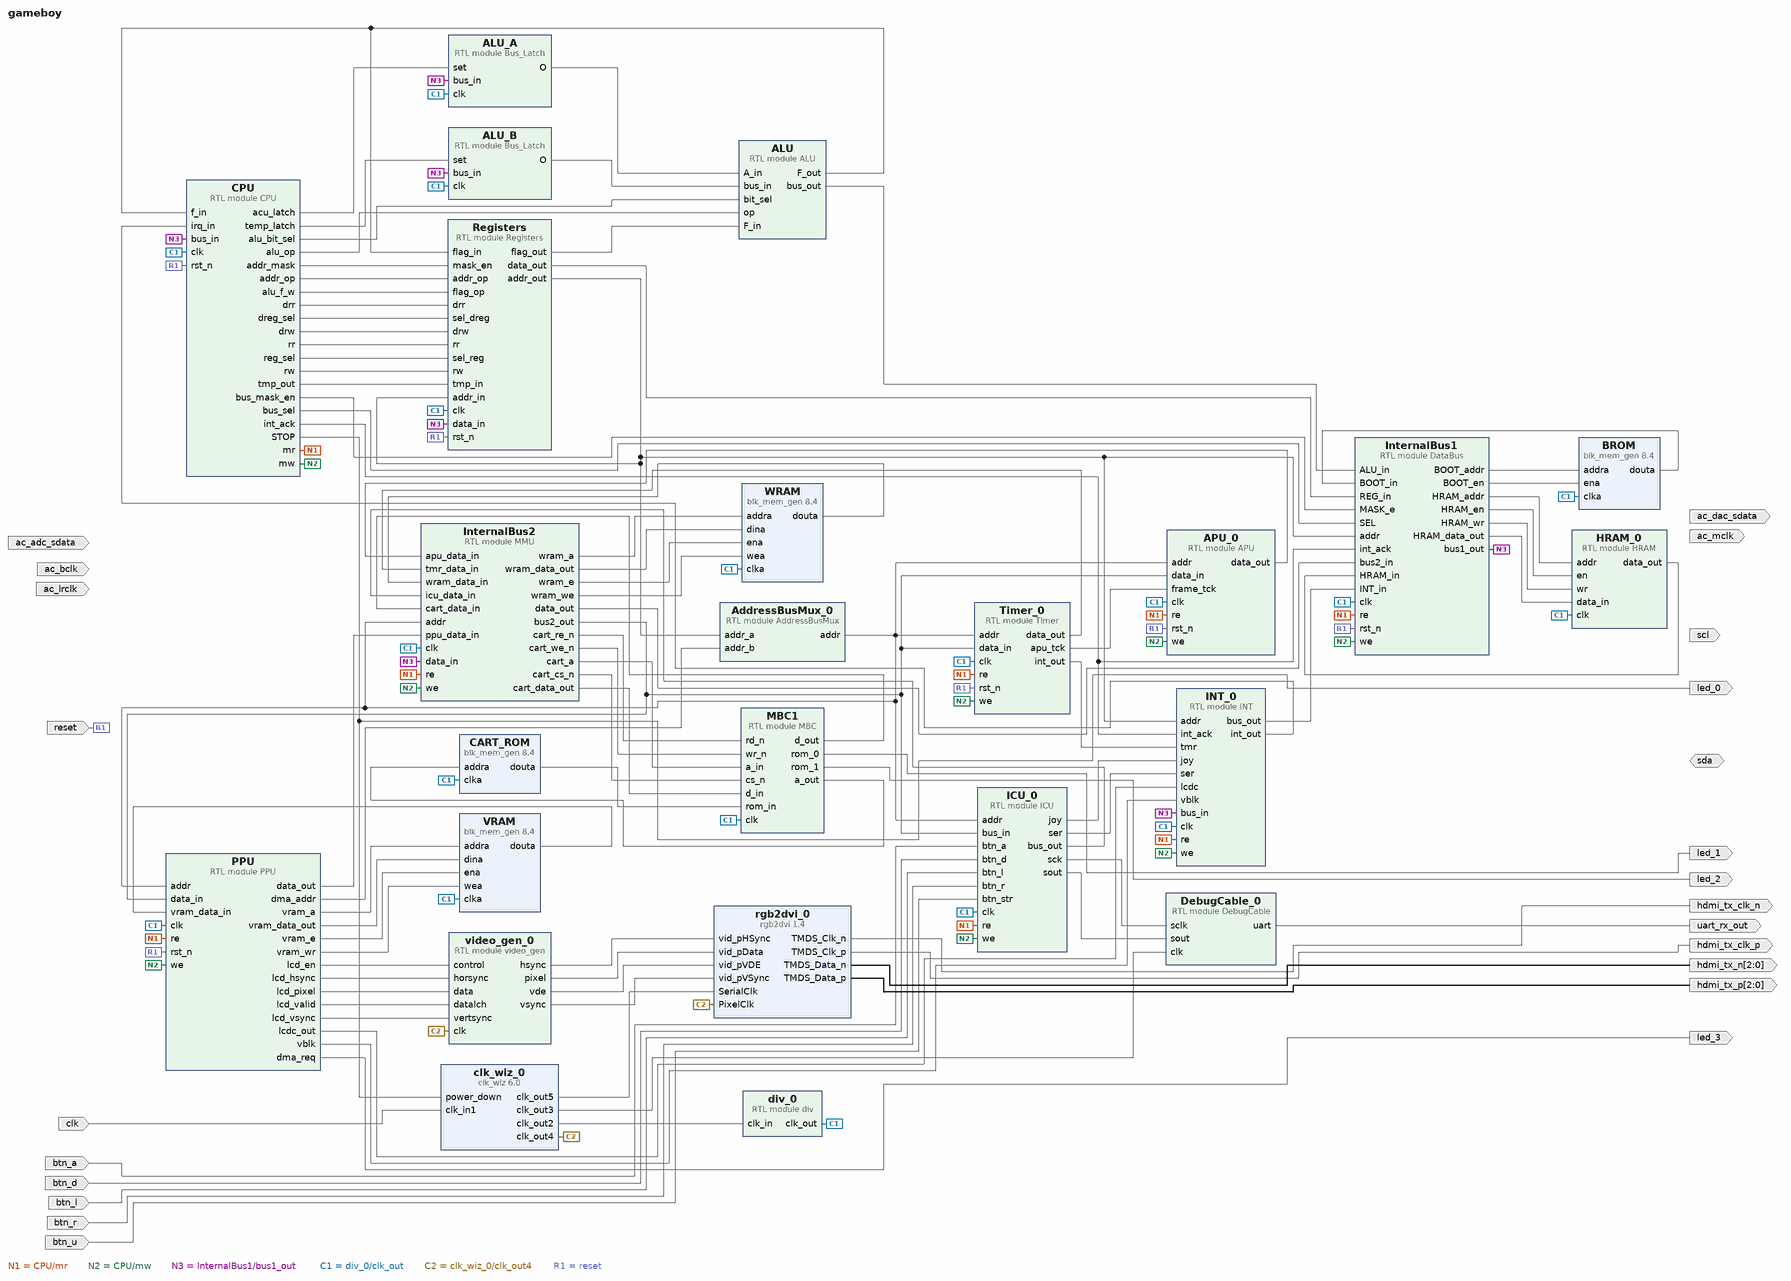
[diagram p0: block diagram of the top level]
# Vivado block design gameboy, xc7a200tsbg484-1, Vivado 2021.2
create_bd_design gameboy

create_bd_port -dir I -type data btn_a
create_bd_port -dir I -type clk clk
set_property -dict {CONFIG.FREQ_HZ 100000000} [get_bd_ports clk]
create_bd_port -dir O -type data led_0
create_bd_port -dir O -type data led_1
create_bd_port -dir O -type data led_2
create_bd_port -dir I -type rst reset
create_bd_port -dir O -type data led_3
create_bd_port -dir IO -type data sda
create_bd_port -dir O -type data scl
create_bd_port -dir I -type data ac_bclk
create_bd_port -dir I -type data ac_lrclk
create_bd_port -dir O -type data ac_dac_sdata
create_bd_port -dir O -type data ac_mclk
create_bd_port -dir I -type data ac_adc_sdata
create_bd_port -dir O -type data uart_rx_out
create_bd_port -dir I -type data btn_l
create_bd_port -dir I -type data btn_r
create_bd_port -dir O -type data hdmi_tx_clk_n
create_bd_port -dir O -type data hdmi_tx_clk_p
create_bd_port -dir O -from 2 -to 0 -type data hdmi_tx_n
create_bd_port -dir O -from 2 -to 0 -type data hdmi_tx_p
create_bd_port -dir I -type data btn_u
create_bd_port -dir I -type data btn_d

create_bd_cell -type ip -vlnv xilinx.com:ip:blk_mem_gen:8.4 WRAM
set_property -dict [list \
  CONFIG.Enable_32bit_Address false \
  CONFIG.Enable_A Use_ENA_Pin \
  CONFIG.Operating_Mode_A READ_FIRST \
  CONFIG.Read_Width_A 8 \
  CONFIG.Register_PortA_Output_of_Memory_Core false \
  CONFIG.Register_PortA_Output_of_Memory_Primitives false \
  CONFIG.Use_Byte_Write_Enable false \
  CONFIG.Use_RSTA_Pin false \
  CONFIG.Write_Depth_A 8192 \
  CONFIG.Write_Width_A 8 \
  CONFIG.use_bram_block Stand_Alone \
] [get_bd_cells WRAM]
create_bd_cell -type ip -vlnv xilinx.com:ip:blk_mem_gen:8.4 BROM
set_property -dict [list \
  CONFIG.Coe_File ../../../../../../../Downloads/COEGen-0.01/dmg_boot.bin.coe \
  CONFIG.Enable_32bit_Address false \
  CONFIG.Load_Init_File true \
  CONFIG.Memory_Type Single_Port_ROM \
  CONFIG.Port_A_Write_Rate 0 \
  CONFIG.Register_PortA_Output_of_Memory_Primitives false \
  CONFIG.Use_RSTA_Pin false \
  CONFIG.Write_Depth_A 256 \
  CONFIG.Write_Width_A 8 \
  CONFIG.use_bram_block Stand_Alone \
] [get_bd_cells BROM]
create_bd_cell -type ip -vlnv xilinx.com:ip:blk_mem_gen:8.4 CART_ROM
set_property -dict [list \
  CONFIG.Coe_File ../../../../../../../Downloads/COEGen-0.01/01-special.gb.coe \
  CONFIG.Enable_32bit_Address false \
  CONFIG.Enable_A Always_Enabled \
  CONFIG.Fill_Remaining_Memory_Locations false \
  CONFIG.Load_Init_File true \
  CONFIG.Memory_Type Single_Port_ROM \
  CONFIG.Port_A_Write_Rate 0 \
  CONFIG.Register_PortA_Output_of_Memory_Core false \
  CONFIG.Register_PortA_Output_of_Memory_Primitives false \
  CONFIG.Use_RSTA_Pin false \
  CONFIG.Write_Depth_A 65536 \
  CONFIG.Write_Width_A 8 \
  CONFIG.use_bram_block Stand_Alone \
] [get_bd_cells CART_ROM]
create_bd_cell -type ip -vlnv xilinx.com:ip:blk_mem_gen:8.4 VRAM
set_property -dict [list \
  CONFIG.Enable_32bit_Address false \
  CONFIG.Operating_Mode_A WRITE_FIRST \
  CONFIG.Read_Width_A 8 \
  CONFIG.Register_PortA_Output_of_Memory_Core false \
  CONFIG.Register_PortA_Output_of_Memory_Primitives false \
  CONFIG.Use_Byte_Write_Enable false \
  CONFIG.Use_RSTA_Pin false \
  CONFIG.Write_Depth_A 8192 \
  CONFIG.Write_Width_A 8 \
  CONFIG.use_bram_block Stand_Alone \
] [get_bd_cells VRAM]
create_bd_cell -type ip -vlnv xilinx.com:ip:clk_wiz:6.0 clk_wiz_0
set_property -dict [list \
  CONFIG.CLKOUT1_DRIVES BUFGCE \
  CONFIG.CLKOUT1_JITTER 147.252 \
  CONFIG.CLKOUT1_PHASE_ERROR 94.994 \
  CONFIG.CLKOUT1_REQUESTED_OUT_FREQ 48 \
  CONFIG.CLKOUT2_DRIVES BUFGCE \
  CONFIG.CLKOUT2_JITTER 209.561 \
  CONFIG.CLKOUT2_PHASE_ERROR 94.994 \
  CONFIG.CLKOUT2_REQUESTED_OUT_FREQ 8.4 \
  CONFIG.CLKOUT2_USED true \
  CONFIG.CLKOUT3_DRIVES BUFGCE \
  CONFIG.CLKOUT3_JITTER 198.395 \
  CONFIG.CLKOUT3_PHASE_ERROR 94.994 \
  CONFIG.CLKOUT3_REQUESTED_OUT_FREQ 11.17021 \
  CONFIG.CLKOUT3_USED true \
  CONFIG.CLKOUT4_DRIVES BUFGCE \
  CONFIG.CLKOUT4_JITTER 158.056 \
  CONFIG.CLKOUT4_PHASE_ERROR 94.994 \
  CONFIG.CLKOUT4_REQUESTED_OUT_FREQ 35 \
  CONFIG.CLKOUT4_USED true \
  CONFIG.CLKOUT5_DRIVES BUFGCE \
  CONFIG.CLKOUT5_JITTER 113.523 \
  CONFIG.CLKOUT5_PHASE_ERROR 94.994 \
  CONFIG.CLKOUT5_REQUESTED_OUT_FREQ 175 \
  CONFIG.CLKOUT5_SEQUENCE_NUMBER 1 \
  CONFIG.CLKOUT5_USED true \
  CONFIG.CLKOUT6_DRIVES BUFGCE \
  CONFIG.CLKOUT7_DRIVES BUFGCE \
  CONFIG.FEEDBACK_SOURCE FDBK_AUTO \
  CONFIG.MMCM_CLKFBOUT_MULT_F 10.500 \
  CONFIG.MMCM_CLKIN1_PERIOD 10.000 \
  CONFIG.MMCM_CLKIN2_PERIOD 10.000 \
  CONFIG.MMCM_CLKOUT0_DIVIDE_F 21.875 \
  CONFIG.MMCM_CLKOUT1_DIVIDE 125 \
  CONFIG.MMCM_CLKOUT2_DIVIDE 94 \
  CONFIG.MMCM_CLKOUT3_DIVIDE 30 \
  CONFIG.MMCM_CLKOUT4_DIVIDE 6 \
  CONFIG.MMCM_DIVCLK_DIVIDE 1 \
  CONFIG.NUM_OUT_CLKS 5 \
  CONFIG.USE_CLOCK_SEQUENCING false \
  CONFIG.USE_LOCKED false \
  CONFIG.USE_POWER_DOWN true \
  CONFIG.USE_RESET false \
  CONFIG.USE_SAFE_CLOCK_STARTUP true \
] [get_bd_cells clk_wiz_0]
create_bd_cell -type ip -vlnv digilentinc.com:ip:rgb2dvi:1.4 rgb2dvi_0
set_property -dict {CONFIG.kGenerateSerialClk false} [get_bd_cells rgb2dvi_0]
create_bd_cell -type module -reference ALU ALU
create_bd_cell -type module -reference DataBus InternalBus1
create_bd_cell -type module -reference CPU CPU
create_bd_cell -type module -reference ICU ICU_0
create_bd_cell -type module -reference INT INT_0
create_bd_cell -type module -reference MBC MBC1
create_bd_cell -type module -reference MMU InternalBus2
create_bd_cell -type module -reference PPU PPU
create_bd_cell -type module -reference Registers Registers
create_bd_cell -type module -reference AddressBusMux AddressBusMux_0
create_bd_cell -type module -reference APU APU_0
create_bd_cell -type module -reference Bus_Latch ALU_B
create_bd_cell -type module -reference Bus_Latch ALU_A
create_bd_cell -type module -reference DebugCable DebugCable_0
create_bd_cell -type module -reference div div_0
create_bd_cell -type module -reference HRAM HRAM_0
create_bd_cell -type module -reference Timer Timer_0
create_bd_cell -type module -reference video_gen video_gen_0

# ---- connections ----

connect_bd_net [get_bd_pins ALU/F_out] [get_bd_pins CPU/f_in] [get_bd_pins Registers/flag_in]
connect_bd_net [get_bd_pins ALU/bus_out] [get_bd_pins InternalBus1/ALU_in]
connect_bd_net [get_bd_pins APU_0/data_out] [get_bd_pins InternalBus2/apu_data_in]
connect_bd_net [get_bd_pins AddressBusMux_0/addr] \
  [get_bd_pins ICU_0/addr] [get_bd_pins InternalBus2/addr] [get_bd_pins PPU/addr] [get_bd_pins APU_0/addr] \
  [get_bd_pins Timer_0/addr]
connect_bd_net [get_bd_pins BROM/douta] [get_bd_pins InternalBus1/BOOT_in]
connect_bd_net -net Bus_Latch_0_O [get_bd_pins ALU_B/O] [get_bd_pins ALU/bus_in]
connect_bd_net -net Bus_Latch_0_O1 [get_bd_pins ALU_A/O] [get_bd_pins ALU/A_in]
connect_bd_net [get_bd_pins CART_ROM/douta] [get_bd_pins MBC1/rom_in]
connect_bd_net [get_bd_pins CPU/STOP] [get_bd_ports led_0] [get_bd_pins clk_wiz_0/power_down]
connect_bd_net [get_bd_pins CPU/acu_latch] [get_bd_pins ALU_A/set]
connect_bd_net -net CPU_addr [get_bd_pins Registers/addr_out] \
  [get_bd_pins InternalBus1/addr] [get_bd_pins INT_0/addr] [get_bd_pins Registers/addr_in] \
  [get_bd_pins AddressBusMux_0/addr_a]
connect_bd_net [get_bd_pins CPU/addr_mask] [get_bd_pins Registers/mask_en]
connect_bd_net [get_bd_pins CPU/addr_op] [get_bd_pins Registers/addr_op]
connect_bd_net [get_bd_pins CPU/alu_bit_sel] [get_bd_pins ALU/bit_sel]
connect_bd_net [get_bd_pins CPU/alu_f_w] [get_bd_pins Registers/flag_op]
connect_bd_net [get_bd_pins CPU/alu_op] [get_bd_pins ALU/op]
connect_bd_net [get_bd_pins CPU/bus_mask_en] [get_bd_pins InternalBus1/MASK_e]
connect_bd_net [get_bd_pins CPU/bus_sel] [get_bd_pins InternalBus1/SEL]
connect_bd_net -net CPU_dreg_r [get_bd_pins CPU/drr] [get_bd_pins Registers/drr]
connect_bd_net [get_bd_pins CPU/dreg_sel] [get_bd_pins Registers/sel_dreg]
connect_bd_net -net CPU_dreg_w [get_bd_pins CPU/drw] [get_bd_pins Registers/drw]
connect_bd_net [get_bd_pins CPU/int_ack] [get_bd_pins InternalBus1/int_ack] [get_bd_pins INT_0/int_ack]
connect_bd_net -net CPU_re [get_bd_pins CPU/mr] \
  [get_bd_pins InternalBus1/re] [get_bd_pins ICU_0/re] [get_bd_pins INT_0/re] [get_bd_pins InternalBus2/re] \
  [get_bd_pins PPU/re] [get_bd_pins APU_0/re] [get_bd_pins Timer_0/re]
connect_bd_net -net CPU_reg_r [get_bd_pins CPU/rr] [get_bd_pins Registers/rr]
connect_bd_net [get_bd_pins CPU/reg_sel] [get_bd_pins Registers/sel_reg]
connect_bd_net -net CPU_reg_w [get_bd_pins CPU/rw] [get_bd_pins Registers/rw]
connect_bd_net [get_bd_pins CPU/temp_latch] [get_bd_pins ALU_B/set]
connect_bd_net [get_bd_pins CPU/tmp_out] [get_bd_pins Registers/tmp_in]
connect_bd_net -net CPU_we [get_bd_pins CPU/mw] \
  [get_bd_pins InternalBus1/we] [get_bd_pins ICU_0/we] [get_bd_pins INT_0/we] [get_bd_pins InternalBus2/we] \
  [get_bd_pins PPU/we] [get_bd_pins APU_0/we] [get_bd_pins Timer_0/we]
connect_bd_net -net DataBus_0_DATA [get_bd_pins InternalBus1/bus1_out] \
  [get_bd_pins CPU/bus_in] [get_bd_pins INT_0/bus_in] [get_bd_pins InternalBus2/data_in] [get_bd_pins Registers/data_in] \
  [get_bd_pins ALU_B/bus_in] [get_bd_pins ALU_A/bus_in]
connect_bd_net -net DataBus_BOOT_addr [get_bd_pins InternalBus1/BOOT_addr] [get_bd_pins BROM/addra]
connect_bd_net -net DataBus_BOOT_en [get_bd_pins InternalBus1/BOOT_en] [get_bd_pins BROM/ena]
connect_bd_net -net DataBus_HRAM_addr [get_bd_pins InternalBus1/HRAM_addr] [get_bd_pins HRAM_0/addr]
connect_bd_net -net DataBus_HRAM_en [get_bd_pins InternalBus1/HRAM_en] [get_bd_pins HRAM_0/en]
connect_bd_net -net DataBus_HRAM_wr [get_bd_pins InternalBus1/HRAM_wr] [get_bd_pins HRAM_0/wr]
connect_bd_net [get_bd_pins DebugCable_0/uart] [get_bd_ports uart_rx_out]
connect_bd_net [get_bd_pins HRAM_0/data_out] [get_bd_pins InternalBus1/HRAM_in]
connect_bd_net [get_bd_pins ICU_0/bus_out] [get_bd_pins InternalBus2/icu_data_in]
connect_bd_net -net ICU_0_int_out [get_bd_pins INT_0/int_out] [get_bd_pins CPU/irq_in]
connect_bd_net [get_bd_pins ICU_0/joy] [get_bd_pins INT_0/joy]
connect_bd_net [get_bd_pins ICU_0/sck] [get_bd_pins DebugCable_0/sclk]
connect_bd_net [get_bd_pins ICU_0/ser] [get_bd_pins INT_0/ser]
connect_bd_net [get_bd_pins ICU_0/sout] [get_bd_pins DebugCable_0/sout]
connect_bd_net [get_bd_pins INT_0/bus_out] [get_bd_pins InternalBus1/INT_in]
connect_bd_net [get_bd_pins InternalBus1/HRAM_data_out] [get_bd_pins HRAM_0/data_in]
connect_bd_net [get_bd_pins InternalBus2/cart_re_n] [get_bd_pins MBC1/rd_n]
connect_bd_net [get_bd_pins InternalBus2/cart_we_n] [get_bd_pins MBC1/wr_n]
connect_bd_net [get_bd_pins MBC1/a_out] [get_bd_pins CART_ROM/addra]
connect_bd_net [get_bd_pins MBC1/d_out] [get_bd_pins InternalBus2/cart_data_in]
connect_bd_net [get_bd_pins MBC1/rom_0] [get_bd_ports led_1]
connect_bd_net [get_bd_pins MBC1/rom_1] [get_bd_ports led_2]
connect_bd_net -net MMU_0_ram_a [get_bd_pins InternalBus2/wram_a] [get_bd_pins WRAM/addra]
connect_bd_net -net MMU_0_ram_data_out [get_bd_pins InternalBus2/wram_data_out] [get_bd_pins WRAM/dina]
connect_bd_net -net MMU_0_ram_e [get_bd_pins InternalBus2/wram_e] [get_bd_pins WRAM/ena]
connect_bd_net -net MMU_0_ram_we [get_bd_pins InternalBus2/wram_we] [get_bd_pins WRAM/wea]
connect_bd_net -net MMU_bus2_out [get_bd_pins InternalBus2/bus2_out] \
  [get_bd_pins ICU_0/bus_in] [get_bd_pins PPU/data_in] [get_bd_pins APU_0/data_in] [get_bd_pins Timer_0/data_in]
connect_bd_net -net MMU_cart_a [get_bd_pins InternalBus2/cart_a] [get_bd_pins MBC1/a_in]
connect_bd_net -net MMU_cart_cs_n [get_bd_pins InternalBus2/cart_cs_n] [get_bd_pins MBC1/cs_n]
connect_bd_net -net MMU_cart_data_out [get_bd_pins InternalBus2/cart_data_out] [get_bd_pins MBC1/d_in]
connect_bd_net -net MMU_data_out [get_bd_pins InternalBus2/data_out] [get_bd_pins InternalBus1/bus2_in]
connect_bd_net [get_bd_pins PPU/data_out] [get_bd_pins InternalBus2/ppu_data_in]
connect_bd_net [get_bd_pins PPU/dma_addr] [get_bd_pins AddressBusMux_0/addr_b]
connect_bd_net [get_bd_pins PPU/dma_req] [get_bd_ports led_3]
connect_bd_net [get_bd_pins PPU/lcd_en] [get_bd_pins video_gen_0/control]
connect_bd_net [get_bd_pins PPU/lcd_hsync] [get_bd_pins video_gen_0/horsync]
connect_bd_net [get_bd_pins PPU/lcd_pixel] [get_bd_pins video_gen_0/data]
connect_bd_net [get_bd_pins PPU/lcd_valid] [get_bd_pins video_gen_0/datalch]
connect_bd_net [get_bd_pins PPU/lcd_vsync] [get_bd_pins video_gen_0/vertsync]
connect_bd_net -net PPU_stat_out [get_bd_pins PPU/lcdc_out] [get_bd_pins INT_0/lcdc]
connect_bd_net [get_bd_pins PPU/vblk] [get_bd_pins INT_0/vblk]
connect_bd_net [get_bd_pins PPU/vram_a] [get_bd_pins VRAM/addra]
connect_bd_net [get_bd_pins PPU/vram_data_out] [get_bd_pins VRAM/dina]
connect_bd_net [get_bd_pins PPU/vram_e] [get_bd_pins VRAM/ena]
connect_bd_net [get_bd_pins PPU/vram_wr] [get_bd_pins VRAM/wea]
connect_bd_net -net Registers_0_data_out [get_bd_pins Registers/data_out] [get_bd_pins InternalBus1/REG_in]
connect_bd_net [get_bd_pins Registers/flag_out] [get_bd_pins ALU/F_in]
connect_bd_net [get_bd_pins Timer_0/apu_tck] [get_bd_pins APU_0/frame_tck]
connect_bd_net [get_bd_pins Timer_0/data_out] [get_bd_pins InternalBus2/tmr_data_in]
connect_bd_net -net Timer_0_int [get_bd_pins Timer_0/int_out] [get_bd_pins INT_0/tmr]
connect_bd_net [get_bd_pins VRAM/douta] [get_bd_pins PPU/vram_data_in]
connect_bd_net -net WRAM_0_douta [get_bd_pins WRAM/douta] [get_bd_pins InternalBus2/wram_data_in]
connect_bd_net [get_bd_ports btn_a] [get_bd_pins ICU_0/btn_a]
connect_bd_net [get_bd_ports btn_d] [get_bd_pins ICU_0/btn_d]
connect_bd_net [get_bd_ports btn_l] [get_bd_pins ICU_0/btn_l]
connect_bd_net [get_bd_ports btn_r] [get_bd_pins ICU_0/btn_r]
connect_bd_net [get_bd_ports btn_u] [get_bd_pins ICU_0/btn_str]
connect_bd_net -net clk [get_bd_pins div_0/clk_out] \
  [get_bd_pins WRAM/clka] [get_bd_pins BROM/clka] [get_bd_pins CART_ROM/clka] [get_bd_pins VRAM/clka] \
  [get_bd_pins InternalBus1/clk] [get_bd_pins CPU/clk] [get_bd_pins ICU_0/clk] [get_bd_pins INT_0/clk] [get_bd_pins MBC1/clk] \
  [get_bd_pins InternalBus2/clk] [get_bd_pins PPU/clk] [get_bd_pins Registers/clk] [get_bd_pins APU_0/clk] \
  [get_bd_pins ALU_B/clk] [get_bd_pins ALU_A/clk] [get_bd_pins HRAM_0/clk] [get_bd_pins Timer_0/clk]
connect_bd_net [get_bd_ports clk] [get_bd_pins clk_wiz_0/clk_in1]
connect_bd_net [get_bd_pins clk_wiz_0/clk_out2] [get_bd_pins div_0/clk_in]
connect_bd_net [get_bd_pins clk_wiz_0/clk_out3] [get_bd_pins DebugCable_0/clk]
connect_bd_net [get_bd_pins clk_wiz_0/clk_out4] [get_bd_pins rgb2dvi_0/PixelClk] [get_bd_pins video_gen_0/clk]
connect_bd_net [get_bd_pins clk_wiz_0/clk_out5] [get_bd_pins rgb2dvi_0/SerialClk]
connect_bd_net [get_bd_ports reset] \
  [get_bd_pins InternalBus1/rst_n] [get_bd_pins CPU/rst_n] [get_bd_pins PPU/rst_n] [get_bd_pins Registers/rst_n] \
  [get_bd_pins APU_0/rst_n] [get_bd_pins Timer_0/rst_n]
connect_bd_net [get_bd_pins rgb2dvi_0/TMDS_Clk_n] [get_bd_ports hdmi_tx_clk_n]
connect_bd_net [get_bd_pins rgb2dvi_0/TMDS_Clk_p] [get_bd_ports hdmi_tx_clk_p]
connect_bd_net [get_bd_pins rgb2dvi_0/TMDS_Data_n] [get_bd_ports hdmi_tx_n]
connect_bd_net [get_bd_pins rgb2dvi_0/TMDS_Data_p] [get_bd_ports hdmi_tx_p]
connect_bd_net [get_bd_pins video_gen_0/hsync] [get_bd_pins rgb2dvi_0/vid_pHSync]
connect_bd_net [get_bd_pins video_gen_0/pixel] [get_bd_pins rgb2dvi_0/vid_pData]
connect_bd_net [get_bd_pins video_gen_0/vde] [get_bd_pins rgb2dvi_0/vid_pVDE]
connect_bd_net [get_bd_pins video_gen_0/vsync] [get_bd_pins rgb2dvi_0/vid_pVSync]

validate_bd_design
save_bd_design
